# EAGLE schematic main (EAGLE 9.3.0)
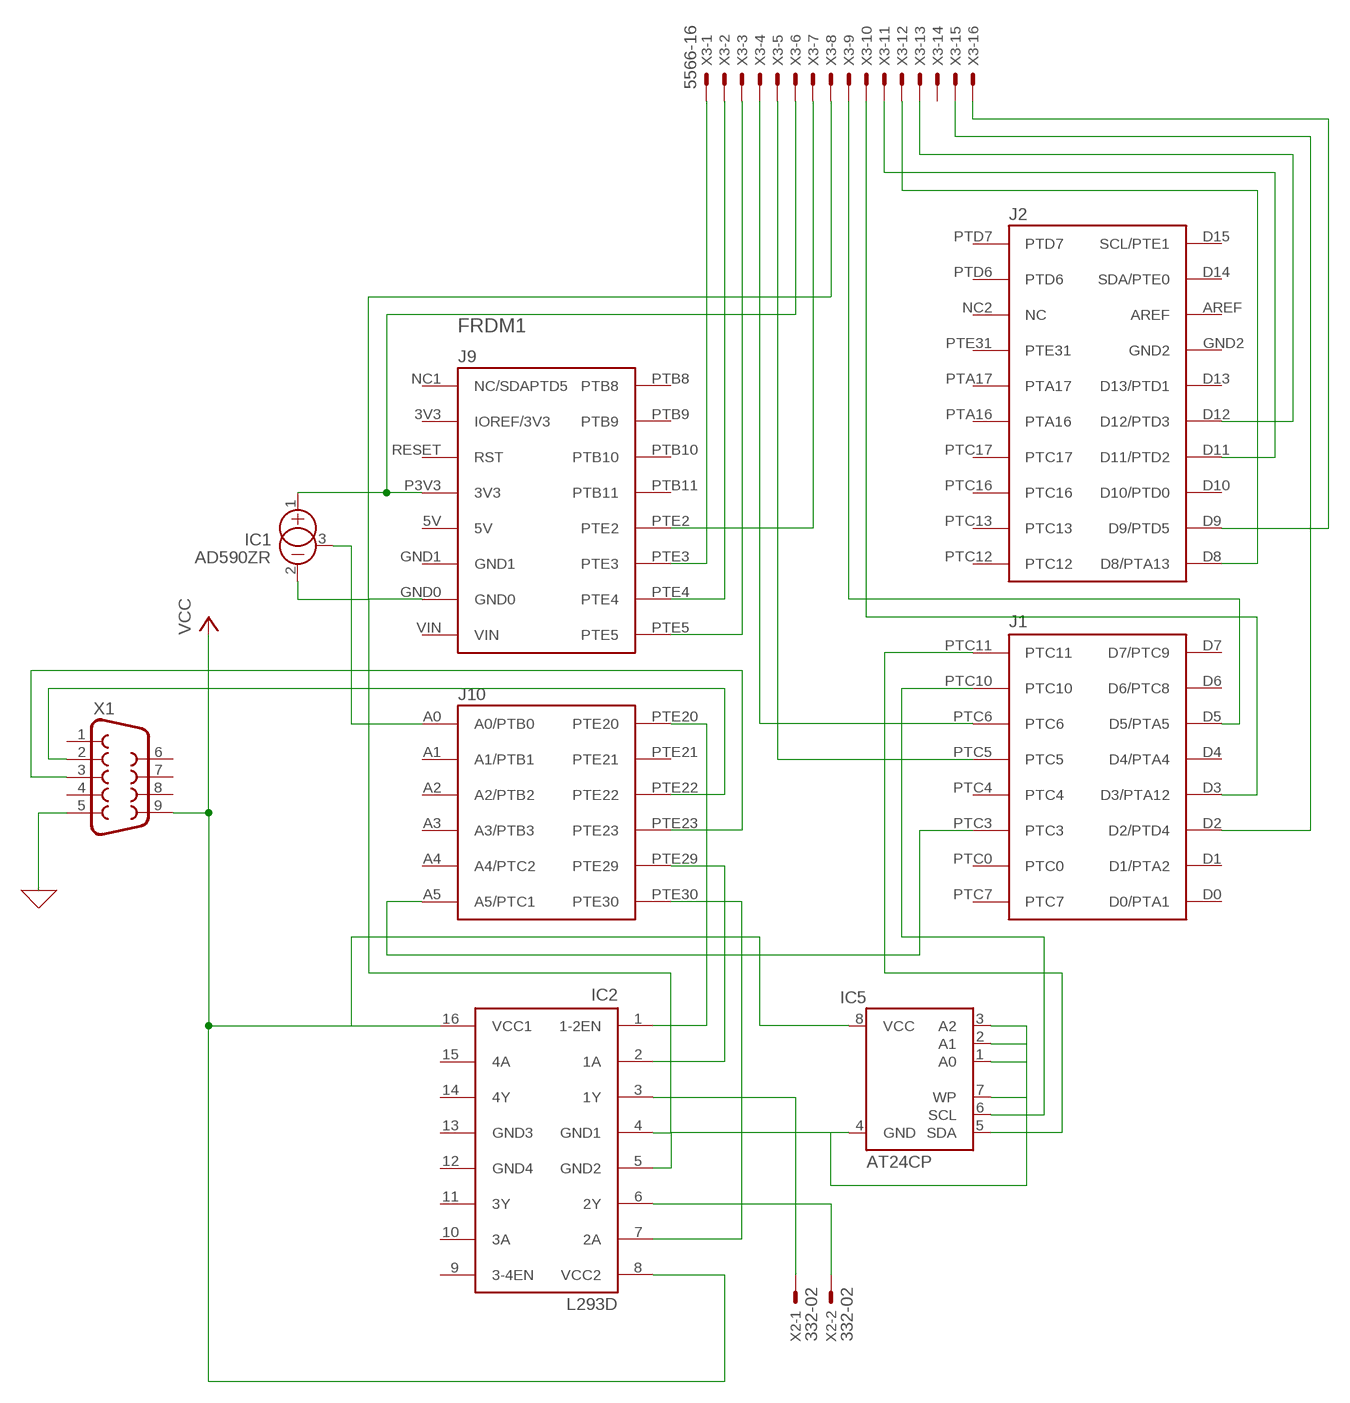
[diagram p0: schematic, sheet 1]

## Parts
FRDM1  FRDM-KL25ZNORMAL  [FRDM_KL25Z_NORMAL]
IC1  AD590ZR  [TO92]
IC2  L293D  [DIL16]
IC5  AT24CP  [DIL08]
X1  F09D  [F09D]
X2  332-02  [332-02]
X3  5566-16  [5566-16]

## Nets
0: X1.5 ; supply symbol labelled GND
N$1: FRDM1.PTE22 X1.2
N$2: FRDM1.PTE23 X1.3
N$3: FRDM1.A5(A5/PTC1) FRDM1.PTC3
N$4: FRDM1.A0(A0/PTB0) IC1.3(CAN)
N$5: IC2.3(1Y) X2.1
N$6: FRDM1.P3V3(3V3) IC1.1(+) X3.6
N$7: FRDM1.PTE20 IC2.1(1-2EN)
N$8: FRDM1.PTE29 IC2.2(1A)
N$9: FRDM1.PTE30 IC2.7(2A)
N$10: IC2.6(2Y) X2.2
N$11: FRDM1.GND0 IC1.2(-) IC2.4(GND1) IC2.5(GND2) IC5.1(A0) IC5.2(A1) IC5.3(A2) IC5.4(GND) IC5.7(WP) X3.8
N$12: FRDM1.PTE3 X3.1
N$13: FRDM1.PTE5 X3.3
N$14: FRDM1.PTE4 X3.2
N$15: FRDM1.PTE2 X3.7
N$16: FRDM1.PTC6 X3.4
N$17: FRDM1.PTC5 X3.5
N$18: FRDM1.D5(D5/PTA5) X3.9
N$19: FRDM1.D3(D3/PTA12) X3.10
N$20: FRDM1.D8(D8/PTA13) X3.12
N$21: FRDM1.D11(D11/PTD2) X3.11
N$22: FRDM1.D12(D12/PTD3) X3.13
N$23: FRDM1.D2(D2/PTD4) X3.15
N$24: FRDM1.D9(D9/PTD5) X3.16
N$27: FRDM1.PTC10 IC5.6(SCL)
N$28: FRDM1.PTC11 IC5.5(SDA)
VCC: IC2.8(VCC2) IC2.16(VCC1) IC5.8(VCC) X1.9
Unconnected: FRDM1.3V3(IOREF/3V3) FRDM1.5V FRDM1.A1(A1/PTB1) FRDM1.A2(A2/PTB2) FRDM1.A3(A3/PTB3) FRDM1.A4(A4/PTC2) FRDM1.AREF FRDM1.D0(D0/PTA1) FRDM1.D1(D1/PTA2) FRDM1.D4(D4/PTA4) FRDM1.D6(D6/PTC8) FRDM1.D7(D7/PTC9) FRDM1.D10(D10/PTD0) FRDM1.D13(D13/PTD1) FRDM1.D14(SDA/PTE0) FRDM1.D15(SCL/PTE1) FRDM1.GND1 FRDM1.GND2 FRDM1.NC1(NC/SDAPTD5) FRDM1.NC2(NC) FRDM1.PTA16 FRDM1.PTA17 FRDM1.PTB8 FRDM1.PTB9 FRDM1.PTB10 FRDM1.PTB11 FRDM1.PTC0 FRDM1.PTC4 FRDM1.PTC7 FRDM1.PTC12 FRDM1.PTC13 FRDM1.PTC16 FRDM1.PTC17 FRDM1.PTD6 FRDM1.PTD7 FRDM1.PTE21 FRDM1.PTE31 FRDM1.RESET(RST) FRDM1.VIN IC2.9(3-4EN) IC2.10(3A) IC2.11(3Y) IC2.14(4Y) IC2.15(4A) X1.1 X1.4 X1.6 X1.7 X1.8 X3.14

## Power pins joined to a net without a drawn wire
GND3: IC2.13(GND3)
GND4: IC2.12(GND4)

## Library data of the parts
FRDM1 = FRDM:FRDM-KL25Z: For creating FRDM-KL25Z shields
IC1 = linear:AD590ZR: TEMPERATURE SENSOR current output
IC2 = st-microelectronics:L293D: PUSH-PULL 4 CHANNEL DRIVER; MPN: L293D; OC_FARNELL: 9589619; OC_NEWARK: 56P8249
IC5 = atmel:AT24C*: 2-wire serial EEPROM; MPN: AT24C1024BW-SH-B; OC_FARNELL: 1362646; OC_NEWARK: 03P2044
X1 = con-subd:F09: SUB-D; OC_FARNELL: unknown; OC_NEWARK: unknown
X2 = con-garry:332-02: 2 Pin - 2mm Dual Row Source: www.mpe-connector.de / garry_shortform_2012.pdf
X3 = con-molex:5566-16: Mini FIT connector 16 pol Source: http://www.molex.com; MF: MOLEX; OC_FARNELL: unknown; OC_NEWARK: unknown